# Altium schematic sheet NETPAGE1.SchDoc
size A4
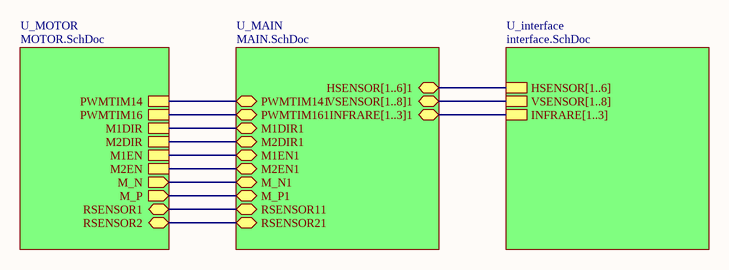
[diagram p0: NETPAGE1.SchDoc]

## Sub-sheets
U_interface = interface.SchDoc: HSENSOR[1..6], VSENSOR[1..8], INFRARE[1..3]
U_MAIN = MAIN.SchDoc: HSENSOR[1..6]1, VSENSOR[1..8]1, PWMTIM141, PWMTIM161, M1DIR1, M2DIR1, M1EN1, M2EN1, M_N1, M_P1, INFRARE[1..3]1, RSENSOR11, RSENSOR21
U_MOTOR = MOTOR.SchDoc: M2DIR, M1DIR, PWMTIM14, PWMTIM16, M1EN, M2EN, M_N, M_P, RSENSOR1, RSENSOR2

## Nets
(unnamed): sheet U_MOTOR/M2DIR, sheet U_MAIN/M2DIR1
(unnamed): sheet U_MOTOR/M1DIR, sheet U_MAIN/M1DIR1
(unnamed): sheet U_MOTOR/PWMTIM14, sheet U_MAIN/PWMTIM141
(unnamed): sheet U_MOTOR/PWMTIM16, sheet U_MAIN/PWMTIM161
(unnamed): sheet U_MOTOR/M1EN, sheet U_MAIN/M1EN1
(unnamed): sheet U_MOTOR/M2EN, sheet U_MAIN/M2EN1
(unnamed): sheet U_MOTOR/M_N, sheet U_MAIN/M_N1
(unnamed): sheet U_MOTOR/M_P, sheet U_MAIN/M_P1
(unnamed): sheet U_MOTOR/RSENSOR1, sheet U_MAIN/RSENSOR11
(unnamed): sheet U_MOTOR/RSENSOR2, sheet U_MAIN/RSENSOR21

## Buses and harness runs
bus sheet U_interface/HSENSOR[1..6] = sheet U_MAIN/HSENSOR[1..6]1
bus sheet U_interface/INFRARE[1..3] = sheet U_MAIN/INFRARE[1..3]1
bus sheet U_interface/VSENSOR[1..8] = sheet U_MAIN/VSENSOR[1..8]1